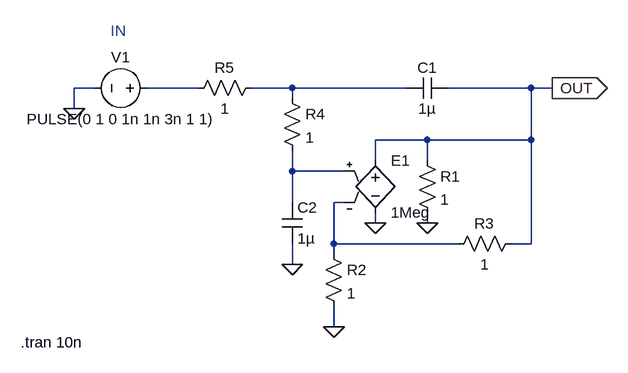
[diagram p0: schematic Sallen-Key low pass filter.asc]
Sallen-Key low pass filter.asc, the LTspice schematic file:
Version 4
SHEET 1 880 680
WIRE -256 32 -288 32
WIRE -96 32 -176 32
WIRE 48 32 -16 32
WIRE 224 32 48 32
WIRE 416 32 288 32
WIRE 448 32 416 32
WIRE 48 48 48 32
WIRE -288 64 -288 32
WIRE 256 112 176 112
WIRE 416 112 416 32
WIRE 416 112 256 112
WIRE 176 144 176 112
WIRE 256 144 256 112
WIRE 48 160 48 128
WIRE 128 160 48 160
WIRE 48 208 48 160
WIRE 128 208 112 208
WIRE 176 240 176 224
WIRE 256 240 256 224
WIRE 112 272 112 208
WIRE 304 272 112 272
WIRE 416 272 416 112
WIRE 416 272 384 272
WIRE 112 288 112 272
WIRE 48 304 48 272
WIRE 112 400 112 368
FLAG 176 240 0
FLAG 256 240 0
FLAG 112 400 0
FLAG 448 32 OUT
IOPIN 448 32 Out
FLAG 48 304 0
FLAG -288 64 0
SYMBOL e 176 128 R0
SYMATTR InstName E1
SYMATTR Value 1Meg
SYMBOL res 240 128 R0
SYMATTR InstName R1
SYMATTR Value 1
SYMBOL res 96 272 R0
SYMATTR InstName R2
SYMATTR Value 1
SYMBOL res 400 256 R90
WINDOW 0 0 56 VBottom 2
WINDOW 3 32 56 VTop 2
SYMATTR InstName R3
SYMATTR Value 1
SYMBOL cap 288 16 R90
WINDOW 0 0 32 VBottom 2
WINDOW 3 32 32 VTop 2
SYMATTR InstName C1
SYMATTR Value 1µ
SYMBOL res 32 32 R0
SYMATTR InstName R4
SYMATTR Value 1
SYMBOL cap 32 208 R0
SYMATTR InstName C2
SYMATTR Value 1µ
SYMBOL res 0 16 R90
WINDOW 0 0 56 VBottom 2
WINDOW 3 32 56 VTop 2
SYMATTR InstName R5
SYMATTR Value 1
SYMBOL voltage -160 32 R90
WINDOW 0 -32 56 VBottom 2
WINDOW 3 32 56 VTop 2
WINDOW 123 0 0 Left 0
SYMATTR InstName V1
SYMATTR Value PULSE(0 1 0 1n 1n 3n 1 1)
TEXT -232 -56 Left 2 ;IN
TEXT -370 424 Left 2 !.tran 10n

The netlist it stands for:
* Sallen-Key low pass filter.asc
E1 OUT 0 N003 N004 1Meg
R1 OUT 0 1
R2 N004 0 1
R3 OUT N004 1
C1 OUT N002 1µ
R4 N002 N003 1
C2 N003 0 1µ
R5 N002 N001 1
V1 N001 0 PULSE(0 1 0 1n 1n 3n 1 1)
* IN
.tran 10n
.backanno
.end